# EAGLE schematic Controller Board (EAGLE 9.1.0)

## Sheet 1 of 2
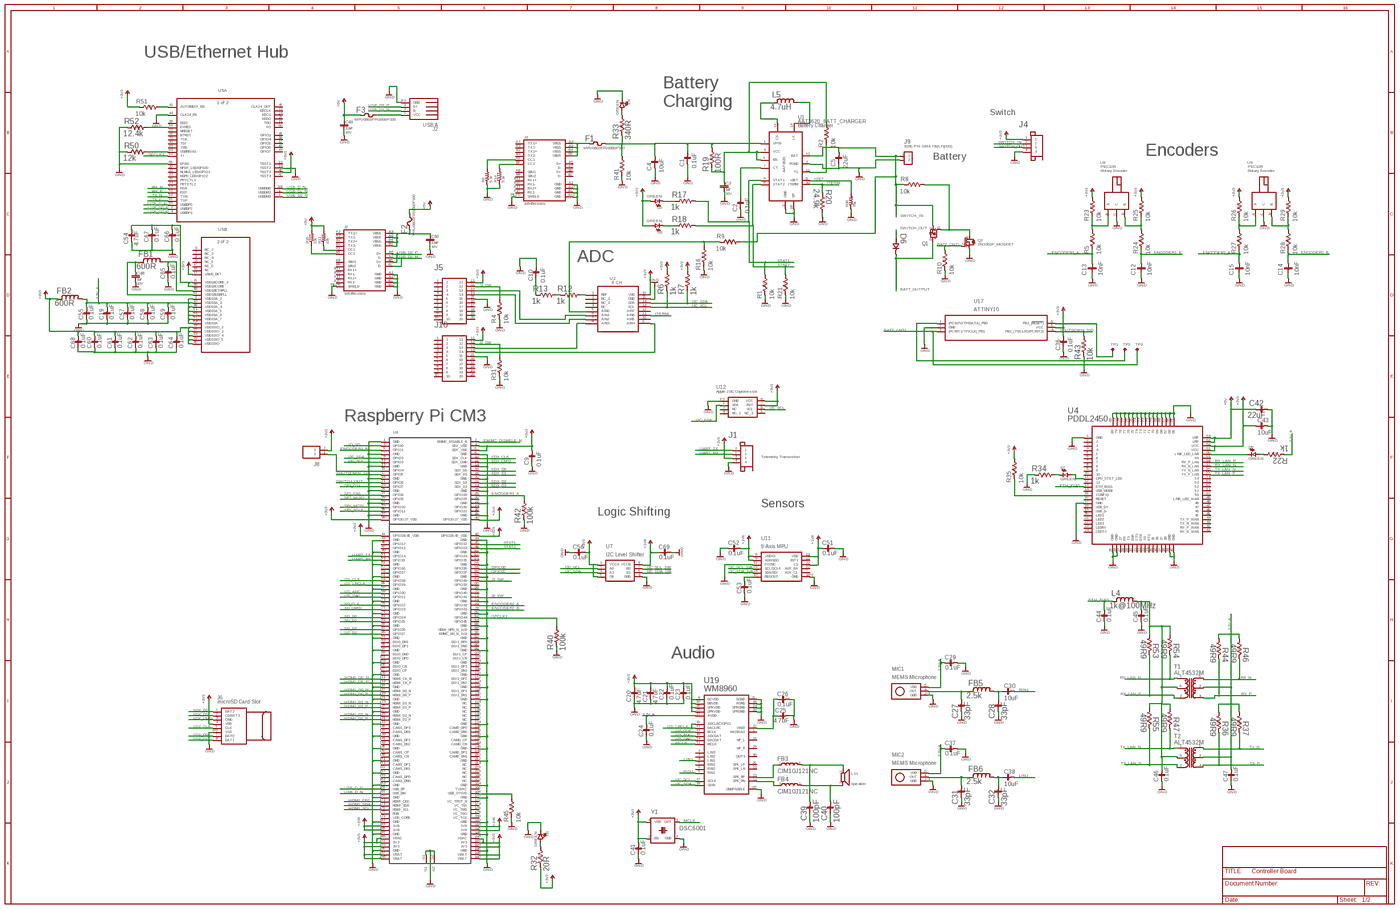
[diagram p0: schematic, sheet 1, overview]
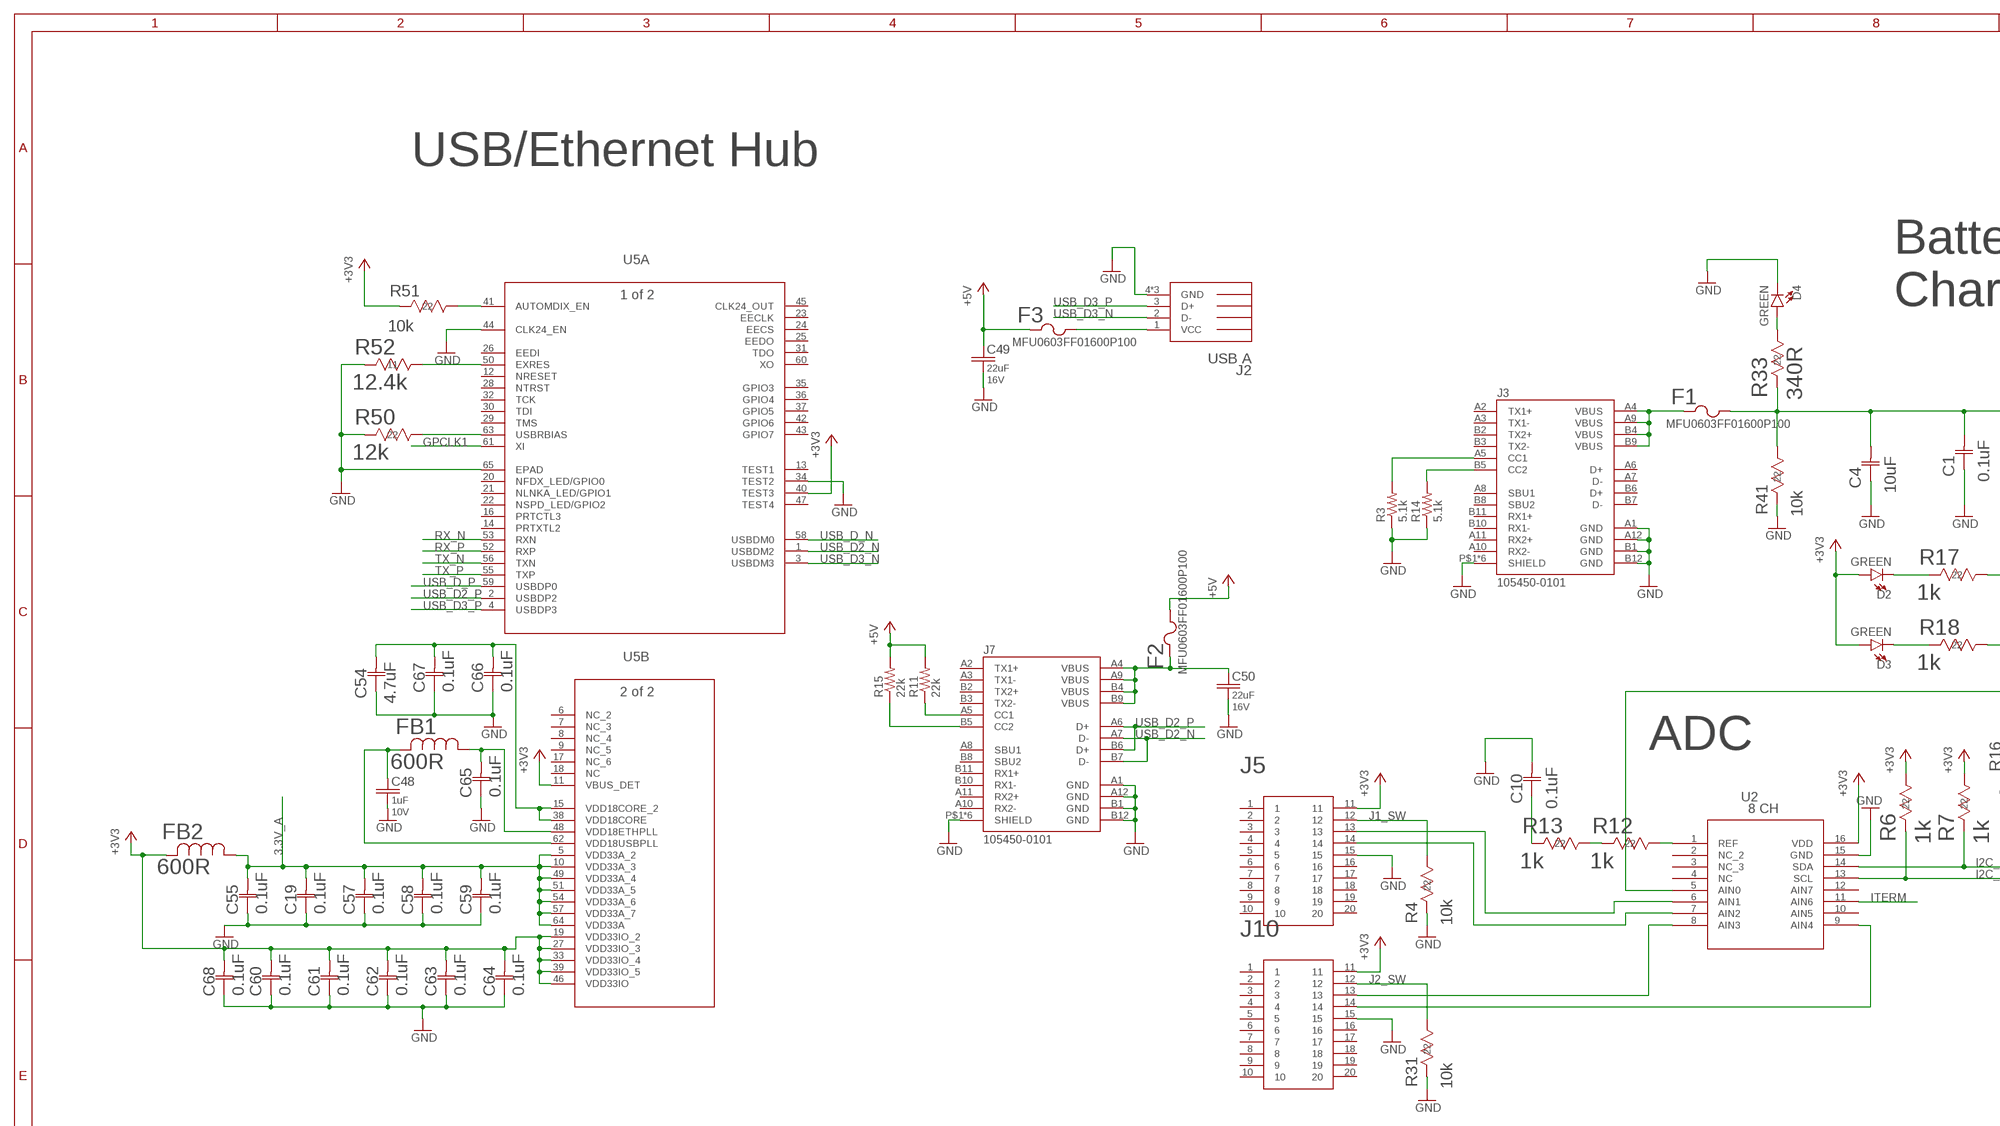
[diagram p1: schematic, sheet 1, part 1 of 4]
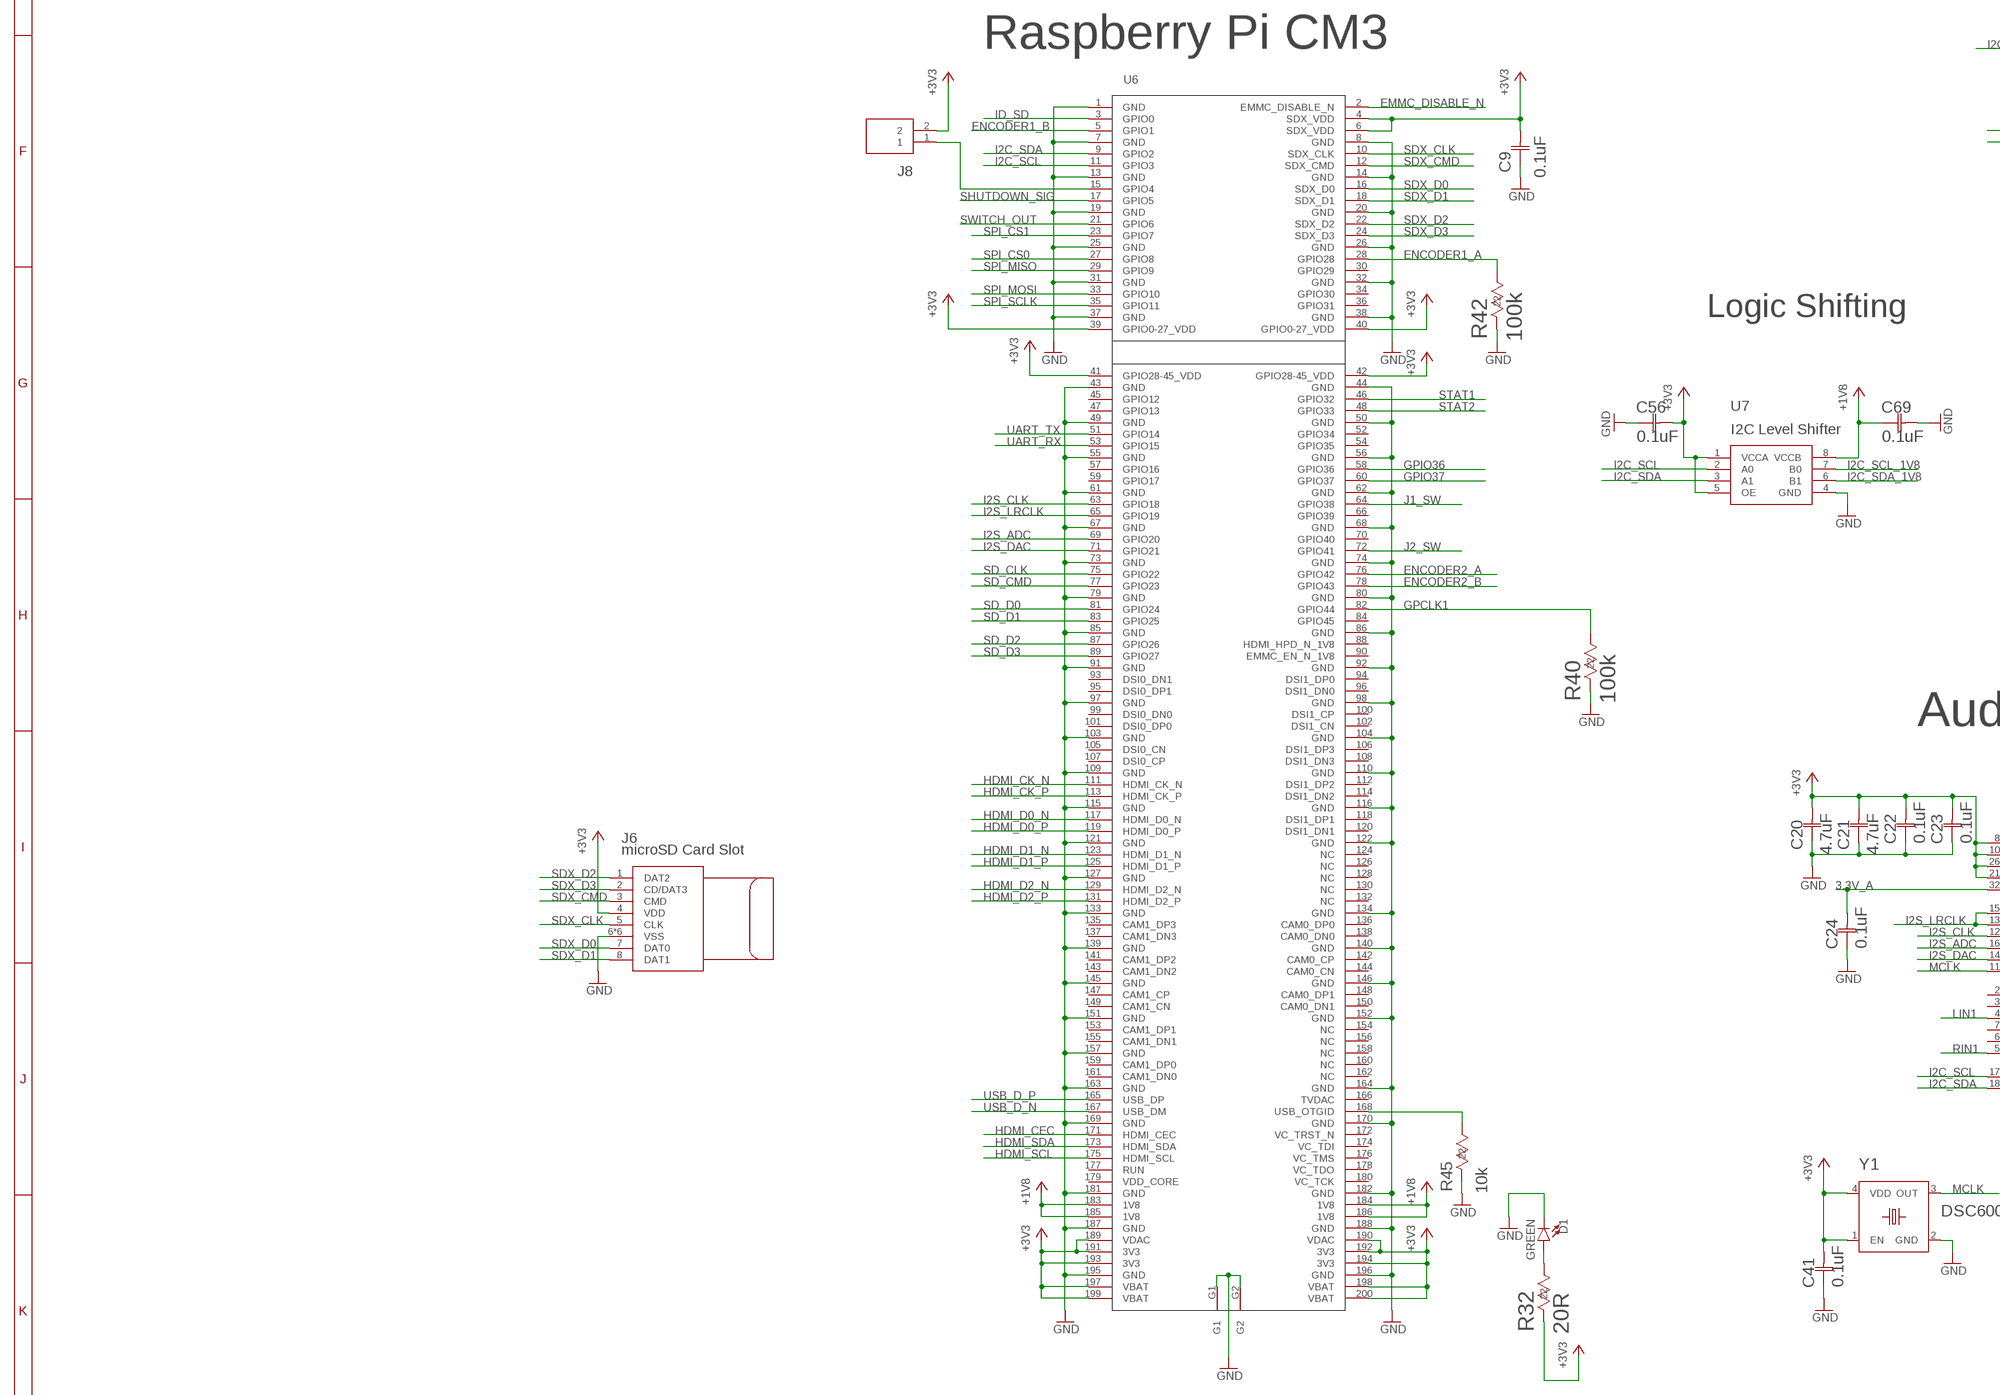
[diagram p2: schematic, sheet 1, part 2 of 4]
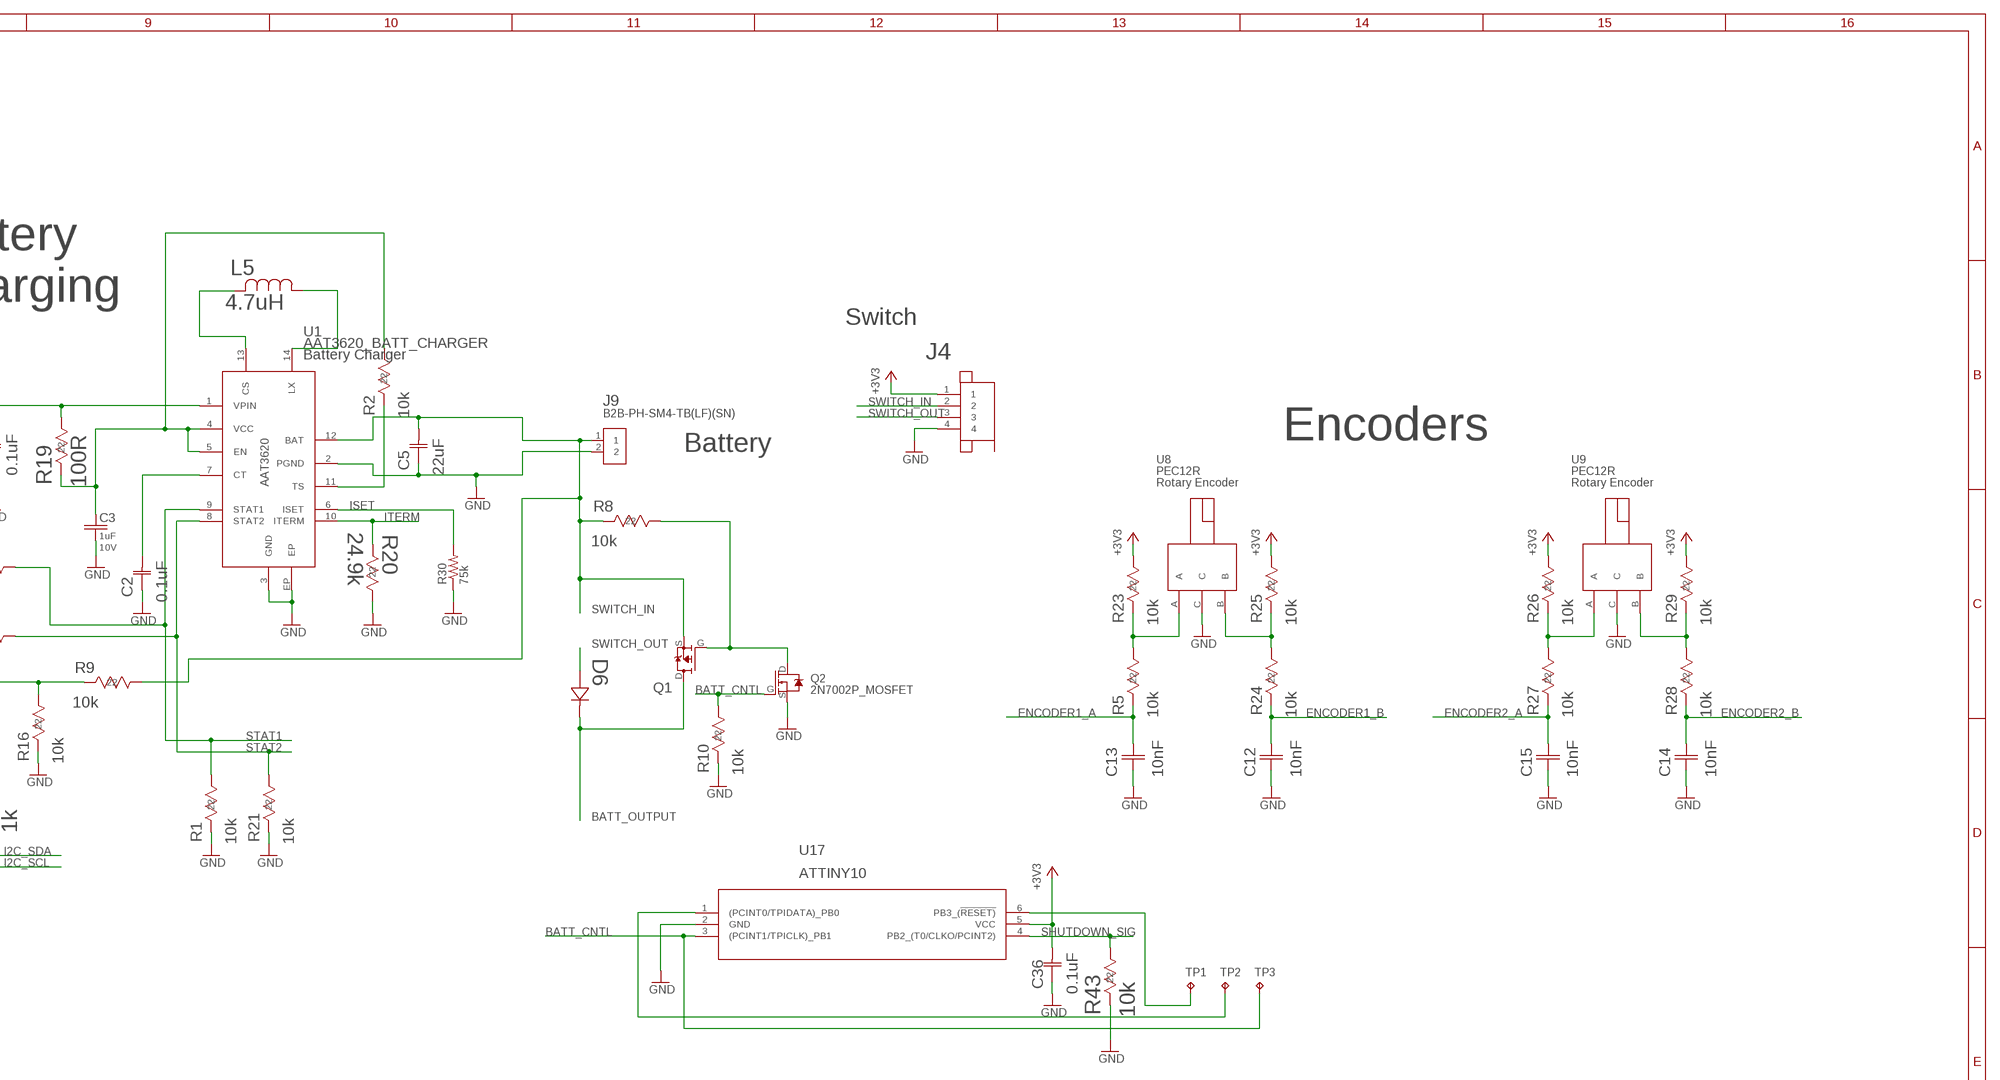
[diagram p3: schematic, sheet 1, part 3 of 4]
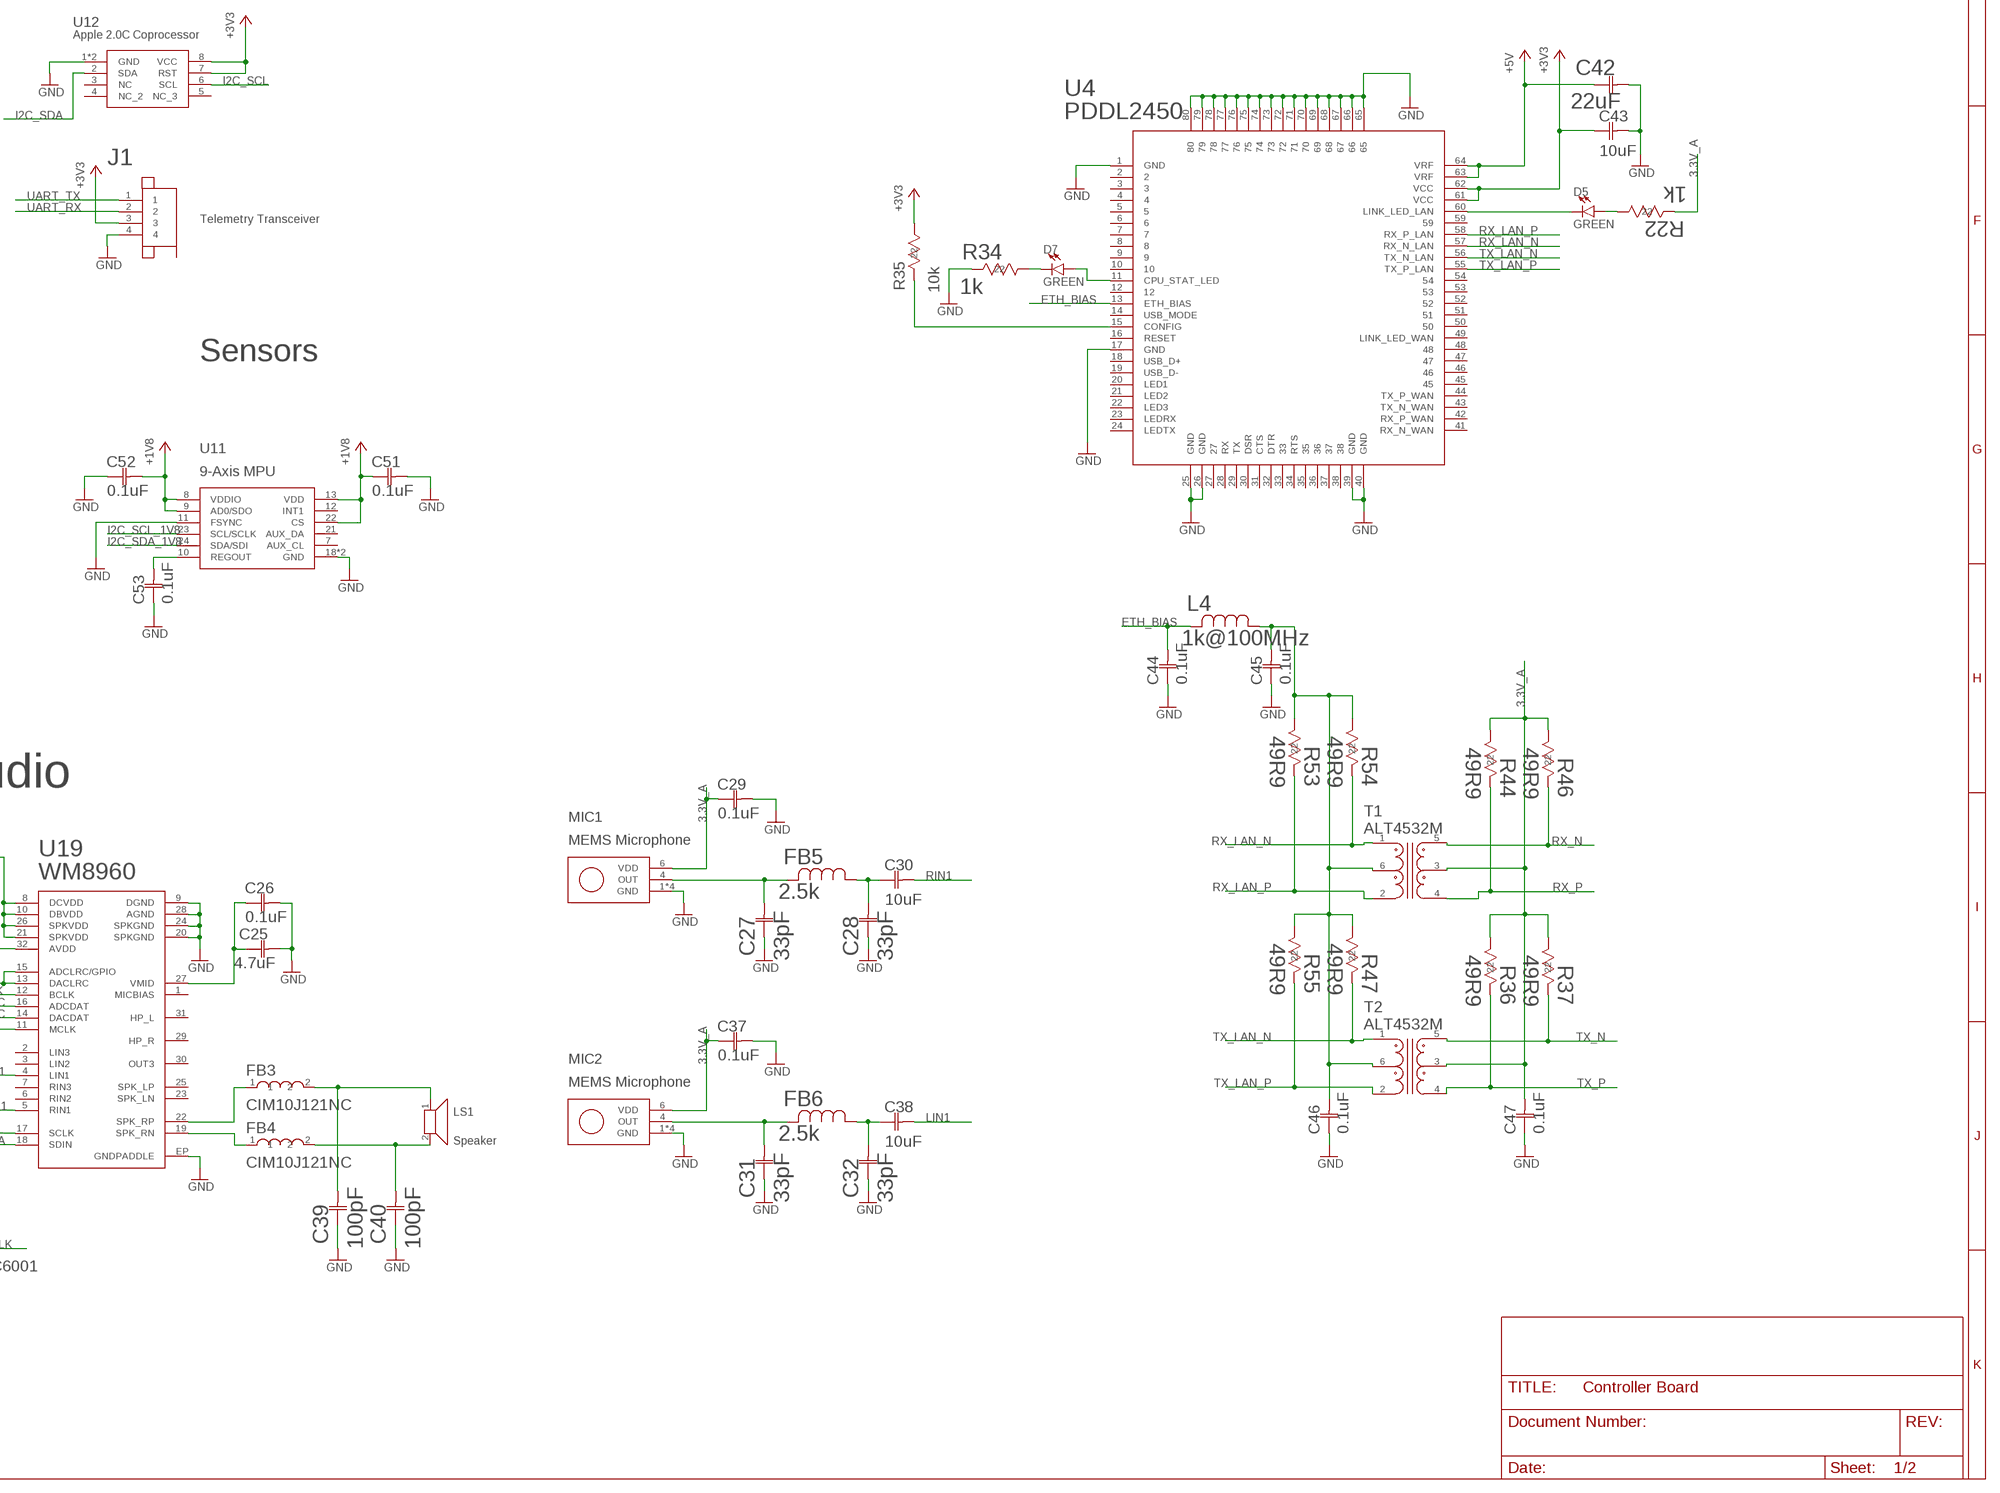
[diagram p4: schematic, sheet 1, part 4 of 4]

### Parts
C1  0.1uF  08055C104KAT2A  [0805]
C2  0.1uF  08055C104KAT2A  [0805]
C3  1uF  CL05A105MP5NNNC  [C0402]
C4  10uF  GRM21BR60J106ME19L  [G-21]
C5  22uF  GRM21BR60J226ME39L  [G-21]
C9  0.1uF  08055C104KAT2A  [0805]
C10  0.1uF  08055C104KAT2A  [0805]
C12  10nF  10NF_CAPACITOR  [0603_CAPACITOR]
C13  10nF  10NF_CAPACITOR  [0603_CAPACITOR]
C14  10nF  10NF_CAPACITOR  [0603_CAPACITOR]
C15  10nF  10NF_CAPACITOR  [0603_CAPACITOR]
C19  0.1uF  0402ZD104KAT2A0402-M  [0402-M]
C20  4.7uF  06036D475KAT2A0603-M  [0603-M]
C21  4.7uF  06036D475KAT2A0603-M  [0603-M]
C22  0.1uF  0402ZD104KAT2A0402-M  [0402-M]
C23  0.1uF  0402ZD104KAT2A0402-M  [0402-M]
C24  0.1uF  0402ZD104KAT2A0402-M  [0402-M]
C25  4.7uF  06036D475KAT2A0603-M  [0603-M]
C26  0.1uF  0402ZD104KAT2A0402-M  [0402-M]
C27  33pF  GRM1555C1H330JA01DG-155-M  [G-155-M]
C28  33pF  GRM1555C1H330JA01DG-155-M  [G-155-M]
C29  0.1uF  0402ZD104KAT2A0402-M  [0402-M]
C30  10uF  GRM21BR60J106ME19L  [G-21]
C31  33pF  GRM1555C1H330JA01DG-155-M  [G-155-M]
C32  33pF  GRM1555C1H330JA01DG-155-M  [G-155-M]
C36  0.1uF  08055C104KAT2A  [0805]
C37  0.1uF  0402ZD104KAT2A0402-M  [0402-M]
C38  10uF  GRM21BR60J106ME19L  [G-21]
C39  100pF  CC0402KRX7R9BB101YAG_CC0402-M  [YAG_CC0402-M]
C40  100pF  CC0402KRX7R9BB101YAG_CC0402-M  [YAG_CC0402-M]
C41  0.1uF  0402ZD104KAT2A0402-M  [0402-M]
C42  22uF  GRM21BR60J226ME39L  [G-21]
C43  10uF  GRM21BR60J106ME19L  [G-21]
C44  0.1uF  0402ZD104KAT2A0402-M  [0402-M]
C45  0.1uF  0402ZD104KAT2A0402-M  [0402-M]
C46  0.1uF  0402ZD104KAT2A0402-M  [0402-M]
C47  0.1uF  0402ZD104KAT2A0402-M  [0402-M]
C48  1uF  CL05A105MP5NNNC  [C0402]
C49  22uF  CL21A226MOCLRNC  [C0805]
C50  22uF  CL21A226MOCLRNC  [C0805]
C51  0.1uF  0402ZD104KAT2A0402-M  [0402-M]
C52  0.1uF  0402ZD104KAT2A0402-M  [0402-M]
C53  0.1uF  0402ZD104KAT2A0402-M  [0402-M]
C54  4.7uF  06036D475KAT2A0603-M  [0603-M]
C55  0.1uF  0402ZD104KAT2A0402-M  [0402-M]
C56  0.1uF  0402ZD104KAT2A0402-M  [0402-M]
C57  0.1uF  0402ZD104KAT2A0402-M  [0402-M]
C58  0.1uF  0402ZD104KAT2A0402-M  [0402-M]
C59  0.1uF  0402ZD104KAT2A0402-M  [0402-M]
C60  0.1uF  0402ZD104KAT2A0402-M  [0402-M]
C61  0.1uF  0402ZD104KAT2A0402-M  [0402-M]
C62  0.1uF  0402ZD104KAT2A0402-M  [0402-M]
C63  0.1uF  0402ZD104KAT2A0402-M  [0402-M]
C64  0.1uF  0402ZD104KAT2A0402-M  [0402-M]
C65  0.1uF  0402ZD104KAT2A0402-M  [0402-M]
C66  0.1uF  0402ZD104KAT2A0402-M  [0402-M]
C67  0.1uF  0402ZD104KAT2A0402-M  [0402-M]
C68  0.1uF  0402ZD104KAT2A0402-M  [0402-M]
C69  0.1uF  0402ZD104KAT2A0402-M  [0402-M]
D1  GREEN  LED-GREEN0603  [LED-0603]
D2  GREEN  LED-GREEN0603  [LED-0603]
D3  GREEN  LED-GREEN0603  [LED-0603]
D4  GREEN  LED-GREEN0603  [LED-0603]
D5  GREEN  LED-GREEN0603  [LED-0603]
D6  1N4148W-7-FSOD123-M  [SOD123-M]
D7  GREEN  LED-GREEN0603  [LED-0603]
F1  MFU0603FF01600P100  [FUS_VISHAY_MFU0603]
F2  MFU0603FF01600P100  [FUS_VISHAY_MFU0603]
F3  MFU0603FF01600P100  [FUS_VISHAY_MFU0603]
FB1  600R  BLM18AG601SN1DIND_BLM18_0603-M  [IND_BLM18_0603-M]
FB2  600R  BLM18AG601SN1DIND_BLM18_0603-M  [IND_BLM18_0603-M]
FB3  CIM10J121NC  [0603_CAPACITOR]
FB4  CIM10J121NC  [0603_CAPACITOR]
FB5  2.5k  BLM18BD252SN1DIND_BLM18_0603-M  [IND_BLM18_0603-M]
FB6  2.5k  BLM18BD252SN1DIND_BLM18_0603-M  [IND_BLM18_0603-M]
J1  JST_SH_4POS  [JST_SH_4POS]
J2  USB_A_RECEPT  [USB_A_RECEPT]
J3  105450-0101  [MOLEX_105450-0101]
J4  JST_SH_4POS  [JST_SH_4POS]
J5  EDGE_CONNECTOR_20POS  [EDGE_CONNECTOR_20POS]
J6  MICROSD  [MICROSD]
J7  105450-0101  [MOLEX_105450-0101]
J8  2_PIN_CONNECTOR  [XH_CONNECTOR]
J9  B2B-PH-SM4-TB(LF)(SN)  [B2B-PH-SM4-TB(LF)(SN)]
J10  EDGE_CONNECTOR_20POS  [EDGE_CONNECTOR_20POS]
L4  1k@100MHz  BLM18AG601SN1DIND_BLM18_0603-M  [IND_BLM18_0603-M]
L5  4.7uH  DFE252012P-4R7M=P2"  [1008]
LS1  SP-1510  [SPEAKER]
MIC1  SPH1642HT5H-1  [SISONIC_MICROPHONE]
MIC2  SPH1642HT5H-1  [SISONIC_MICROPHONE]
Q1  DMP3099L  [SOT-23_(TO-236AB)]
Q2  2N7002P_MOSFET  [SOT-23_(TO-236AB)]
R1  10k  RC0603JR-0710KLRC0603N-M  [RC0603N-M]
R2  10k  RC0603JR-0710KLRC0603N-M  [RC0603N-M]
R3  5.1k  RMCF0603JT5K10  [R0603]
R4  10k  RC0603JR-0710KLRC0603N-M  [RC0603N-M]
R5  10k  RC0603JR-0710KLRC0603N-M  [RC0603N-M]
R6  1k  RC0603JR-071KLRC0603N-M  [RC0603N-M]
R7  1k  RC0603JR-071KLRC0603N-M  [RC0603N-M]
R8  10k  RC0603JR-0710KLRC0603N-M  [RC0603N-M]
R9  10k  RC0603JR-0710KLRC0603N-M  [RC0603N-M]
R10  10k  RC0603JR-0710KLRC0603N-M  [RC0603N-M]
R11  22k  RMCF0603JT22K0  [R0603]
R12  1k  RC0603JR-071KLRC0603N-M  [RC0603N-M]
R13  1k  RC0603JR-071KLRC0603N-M  [RC0603N-M]
R14  5.1k  RMCF0603JT5K10  [R0603]
R15  22k  RMCF0603JT22K0  [R0603]
R16  10k  RC0603JR-0710KLRC0603N-M  [RC0603N-M]
R17  1k  RC0603JR-071KLRC0603N-M  [RC0603N-M]
R18  1k  RC0603JR-071KLRC0603N-M  [RC0603N-M]
R19  100R  RC0603JR-07100RLRC0603N-M  [RC0603N-M]
R20  24.9k  RC0402FR-0724K9LRC0402N-M  [RC0402N-M]
R21  10k  RC0603JR-0710KLRC0603N-M  [RC0603N-M]
R22  1k  RC0603JR-071KLRC0603N-M  [RC0603N-M]
R23  10k  RC0603JR-0710KLRC0603N-M  [RC0603N-M]
R24  10k  RC0603JR-0710KLRC0603N-M  [RC0603N-M]
R25  10k  RC0603JR-0710KLRC0603N-M  [RC0603N-M]
R26  10k  RC0603JR-0710KLRC0603N-M  [RC0603N-M]
R27  10k  RC0603JR-0710KLRC0603N-M  [RC0603N-M]
R28  10k  RC0603JR-0710KLRC0603N-M  [RC0603N-M]
R29  10k  RC0603JR-0710KLRC0603N-M  [RC0603N-M]
R30  75k  RMCF0603JT75K0  [R0603]
R31  10k  RC0603JR-0710KLRC0603N-M  [RC0603N-M]
R32  20R  RC0603JR-0720RLRC0603N-M  [RC0603N-M]
R33  340R  RC0603FR-07340RL  [RC0603N]
R34  1k  RC0603JR-071KLRC0603N-M  [RC0603N-M]
R35  10k  RC0603JR-0710KLRC0603N-M  [RC0603N-M]
R36  49R9  RC0402FR-0749K9LRC0402N-M  [RC0402N-M]
R37  49R9  RC0402FR-0749K9LRC0402N-M  [RC0402N-M]
R40  100k  RC0603JR-07100KLRC0603N-M  [RC0603N-M]
R41  10k  RC0603JR-0710KLRC0603N-M  [RC0603N-M]
R42  100k  RC0603JR-07100KLRC0603N-M  [RC0603N-M]
R43  10k  ERA-6AEB103V  [RC0805N]
R44  49R9  RC0402FR-0749K9LRC0402N-M  [RC0402N-M]
R45  10k  RC0603JR-0710KLRC0603N-M  [RC0603N-M]
R46  49R9  RC0402FR-0749K9LRC0402N-M  [RC0402N-M]
R47  49R9  RC0402FR-0749K9LRC0402N-M  [RC0402N-M]
R50  12k  RC0402FR-0712KLRC0402N-M  [RC0402N-M]
R51  10k  RC0603JR-0710KLRC0603N-M  [RC0603N-M]
R52  12.4k  RC0402FR-0712K4LYAG_R0402-M  [YAG_R0402-M]
R53  49R9  RC0402FR-0749K9LRC0402N-M  [RC0402N-M]
R54  49R9  RC0402FR-0749K9LRC0402N-M  [RC0402N-M]
R55  49R9  RC0402FR-0749K9LRC0402N-M  [RC0402N-M]
T1  ALT4532M  [ALT4532]
T2  ALT4532M  [ALT4532]
TP1  TPB2,54  [B2,54]
TP2  TPB2,54  [B2,54]
TP3  TPB2,54  [B2,54]
U1  AAT3620_BATT_CHARGER  [AAT3620_TDFN]
U2  8 CH  MAX11608EEE+21-0055H_16-M  [21-0055H_16-M]
U4  PDDL2450  [PDDL2450_SOCKET]
U5  LAN9512-JZXQFN64_9X9MC-M  [QFN64_9X9MC-M]
U6  COMPUTE_MODULE  [SO-DIMM]
U7  FXMAR2102  [8-UMLP]
U8  PEC12R  [PEC12R]
U9  PEC12R  [PEC12R]
U11  ICM-20948  [QFN40P300X300X105-25N]
U12  APPLE_2.0C_COPROCESSOR  [PG-USON-8-1]
U17  ATTINY10-TSHR6ST1-M  [6ST1-M]
U19  WM8960  [32QFN]
Y1  DSC6001  [4-VFLGA]

### Nets
3.3V_A: C19.2 C24.2 C29.1 C37.1 C47.2 C55.2 C57.2 C58.2 C59.2 FB2.1 MIC1.6(VDD) MIC2.6(VDD) R22.2 R36.1 R37.1 R44.1 R46.1 T1.3 T2.3 U5.5(B:VDD33A_2) U5.10(B:VDD33A_3) U5.49(B:VDD33A_4) U5.51(B:VDD33A_5) U5.54(B:VDD33A_6) U5.57(B:VDD33A_7) U5.64(B:VDD33A) U19.32(AVDD)
+1V8: C51.1 C52.2 C69.1 U6.183(1V8) U6.184(1V8) U6.185(1V8) U6.186(1V8) U7.8(VCCB) U11.8(VDDIO) U11.9(AD0/SDO) U11.13(VDD) U11.22(CS) ; also sheet 2
+3V3: C9.2 C20.2 C21.2 C22.2 C23.2 C36.2 C41.2 C43.1 C56.2 C60.2 C61.2 C62.2 C63.2 C64.2 C68.2 D2.A D3.A FB2.2 J1.3 J4.1 J5.11 J6.4(VDD) J8.2 J10.11 R6.1 R7.1 R23.1 R25.1 R26.1 R29.1 R32.2 R35.1 R51.2 U2.16(VDD) U4.61(VCC) U4.62(VCC) U5.11(B:VBUS_DET) U5.19(B:VDD33IO_2) U5.27(B:VDD33IO_3) U5.33(B:VDD33IO_4) U5.39(B:VDD33IO_5) U5.40(A:TEST3) U5.46(B:VDD33IO) U6.4(SDX_VDD) U6.6(SDX_VDD) U6.39(GPIO0-27_VDD) U6.40(GPIO0-27_VDD) U6.41(GPIO28-45_VDD) U6.42(GPIO28-45_VDD) U6.189(VDAC) U6.190(VDAC) U6.191(3V3) U6.192(3V3) U6.193(3V3) U6.194(3V3) U6.197(VBAT) U6.198(VBAT) U6.199(VBAT) U6.200(VBAT) U7.1(VCCA) U7.5(OE) U12.7(RST) U12.8(VCC) U17.5(VCC) U19.8(DCVDD) U19.10(DBVDD) U19.21(SPKVDD) U19.26(SPKVDD) Y1.1(EN) Y1.4(VDD) ; also sheet 2
+5V: C42.1 C49.1 F2.2 F3.1 R11.2 R15.2 U4.63(VRF) U4.64(VRF) ; also sheet 2
BATT_CNTL: Q2.G R10.1 TP3.TP U17.3((PCINT1/TPICLK)_PB1)
BATT_OUTPUT: D6.C Q1.D ; also sheet 2
EMMC_DISABLE_N: U6.2(EMMC_DISABLE_N)
ENCODER1_A: C13.2 R5.2 R42.1 U6.28(GPIO28)
ENCODER1_B: C12.2 R24.2 U6.5(GPIO1)
ENCODER2_A: C15.2 R27.2 U6.76(GPIO42)
ENCODER2_B: C14.2 R28.2 U6.78(GPIO43)
ETH_BIAS: C44.2 L4.2 U4.13(ETH_BIAS)
GND: C1.1 C2.1 C3.2 C4.1 C5.1 C9.1 C10.2 C12.1 C13.1 C14.1 C15.1 C19.1 C20.1 C21.1 C22.1 C23.1 C24.1 C25.2 C26.2 C27.1 C28.1 C29.2 C31.1 C32.1 C36.1 C37.2 C39.1 C40.1 C41.1 C42.2 C43.2 C44.1 C45.1 C46.1 C47.1 C48.2 C49.2 C50.2 C51.2 C52.1 C53.1 C54.1 C55.1 C56.1 C57.1 C58.1 C59.1 C60.1 C61.1 C62.1 C63.1 C64.1 C65.1 C66.1 C67.1 C68.1 C69.2 D1.C D4.C J1.4 J2.4(GND) J2.5(GND) J2.6(GND) J3.A1(GND) J3.A12(GND) J3.B1(GND) J3.B12(GND) J3.P$1(SHIELD) J3.P$2(SHIELD) J3.P$3(SHIELD) J3.P$4(SHIELD) J3.P$5(SHIELD) J3.P$6(SHIELD) J4.4 J5.15 J6.6(VSS) J6.9(VSS) J6.10(VSS) J6.11(VSS) J6.12(VSS) J6.13(VSS) J7.A1(GND) J7.A12(GND) J7.B1(GND) J7.B12(GND) J7.P$1(SHIELD) J7.P$2(SHIELD) J7.P$3(SHIELD) J7.P$4(SHIELD) J7.P$5(SHIELD) J7.P$6(SHIELD) J9.2 J10.15 MIC1.1(GND) MIC1.2(GND) MIC1.3(GND) MIC1.5(GND) MIC2.1(GND) MIC2.2(GND) MIC2.3(GND) MIC2.5(GND) Q2.S R1.2 R3.1 R4.2 R10.2 R14.1 R16.2 R20.1 R21.2 R30.1 R31.2 R34.2 R40.2 R41.2 R42.2 R43.2 R45.2 R50.2 R52.1 U1.2(PGND) U1.3(GND) U1.EP U2.15(GND) U4.1(GND) U4.17(GND) U4.25(GND) U4.26(GND) U4.39(GND) U4.40(GND) U4.65 U4.66 U4.67 U4.68 U4.69 U4.70 U4.71 U4.72 U4.73 U4.74 U4.75 U4.76 U4.77 U4.78 U4.79 U4.80 U5.34(A:TEST2) U5.44(A:CLK24_EN) U5.65(A:EPAD) U6.1(GND) U6.7(GND) U6.8(GND) U6.13(GND) U6.14(GND) U6.19(GND) U6.20(GND) U6.25(GND) U6.26(GND) U6.31(GND) U6.32(GND) U6.37(GND) U6.38(GND) U6.43(GND) U6.44(GND) U6.49(GND) U6.50(GND) U6.55(GND) U6.56(GND) U6.61(GND) U6.62(GND) U6.67(GND) U6.68(GND) U6.73(GND) U6.74(GND) U6.79(GND) U6.80(GND) U6.85(GND) U6.86(GND) U6.91(GND) U6.92(GND) U6.97(GND) U6.98(GND) U6.103(GND) U6.104(GND) U6.109(GND) U6.110(GND) U6.115(GND) U6.116(GND) U6.121(GND) U6.122(GND) U6.127(GND) U6.133(GND) U6.134(GND) U6.139(GND) U6.140(GND) U6.145(GND) U6.146(GND) U6.151(GND) U6.152(GND) U6.157(GND) U6.163(GND) U6.164(GND) U6.169(GND) U6.170(GND) U6.181(GND) U6.182(GND) U6.187(GND) U6.188(GND) U6.195(GND) U6.196(GND) U6.G1 U6.G2 U7.4(GND) U8.C U9.C U11.11(FSYNC) U11.18(GND) U11.20(GND) U12.1(GND) U12.9(GND) U17.2(GND) U19.9(DGND) U19.20(SPKGND) U19.24(SPKGND) U19.28(AGND) U19.EP(GNDPADDLE) Y1.2(GND) ; also sheet 2
GND2: D5.C U4.60(LINK_LED_LAN)
GPCLK1: R40.1 U5.61(A:XI) U6.82(GPIO44)
GPIO36: U6.58(GPIO36)
GPIO37: U6.60(GPIO37)
HDMI_CEC: U6.171(HDMI_CEC)
HDMI_CK_N: U6.111(HDMI_CK_N)
HDMI_CK_P: U6.113(HDMI_CK_P)
HDMI_D0_N: U6.117(HDMI_D0_N)
HDMI_D0_P: U6.119(HDMI_D0_P)
HDMI_D1_N: U6.123(HDMI_D1_N)
HDMI_D1_P: U6.125(HDMI_D1_P)
HDMI_D2_N: U6.129(HDMI_D2_N)
HDMI_D2_P: U6.131(HDMI_D2_P)
HDMI_SCL: U6.175(HDMI_SCL)
HDMI_SDA: U6.173(HDMI_SDA)
I2C_SCL: R6.2 U2.13(SCL) U6.11(GPIO3) U7.2(A0) U12.6(SCL) U19.17(SCLK)
I2C_SCL_1V8: U7.7(B0) U11.23(SCL/SCLK)
I2C_SDA: R7.2 U2.14(SDA) U6.9(GPIO2) U7.3(A1) U12.2(SDA) U19.18(SDIN)
I2C_SDA_1V8: U7.6(B1) U11.24(SDA/SDI)
I2S_ADC: U6.69(GPIO20) U19.16(ADCDAT)
I2S_CLK: U6.63(GPIO18) U19.12(BCLK)
I2S_DAC: U6.71(GPIO21) U19.14(DACDAT)
I2S_LRCLK: U6.65(GPIO19) U19.13(DACLRC) U19.15(ADCLRC/GPIO)
ID_SD: U6.3(GPIO0)
ISET: R30.2 U1.6(ISET)
ITERM: R20.2 U1.10(ITERM) U2.11(AIN6)
J1_SW: J5.12 R4.1 U6.64(GPIO38)
J2_SW: J10.12 R31.1 U6.72(GPIO41)
LIN1: C38.2 U19.4(LIN1)
MCLK: U19.11(MCLK) Y1.3(OUT)
N$1: TP1.TP U17.6(PB3_(!RESET))
N$2: C2.2 U1.7(CT)
N$4: L5.P$2 U1.13(CS)
N$5: L5.P$1 U1.14(LX)
N$6: C3.1 R2.1 R19.2 U1.4(VCC) U1.5(EN)
N$7: C53.2 U11.10(REGOUT)
N$9: D4.A R33.1
N$10: D1.A R32.1
N$11: R2.2 U1.11(TS)
N$14: C25.1 C26.1 U19.27(VMID)
N$15: D2.C R17.2
N$16: R12.1 U2.1(REF)
N$17: J5.13 U2.6(AIN1)
N$18: J5.14 U2.7(AIN2)
N$19: J10.13 U2.8(AIN3)
N$20: J10.14 U2.9(AIN4)
N$21: C27.2 FB5.2 MIC1.4(OUT)
N$22: D3.C R18.2
N$24: R12.2 R13.1
N$28: C10.1 R13.2
N$31: R5.1 R23.2 U8.A
N$33: C28.2 C30.1 FB5.1
N$34: R24.1 R25.2 U8.B
N$35: C31.2 FB6.2 MIC2.4(OUT)
N$36: C32.2 C38.1 FB6.1
N$37: R26.2 R27.1 U9.A
N$38: R28.1 R29.2 U9.B
N$39: R9.2 R16.1 U2.5(AIN0)
N$41: FB4.1 U19.19(SPK_RN)
N$43: FB3.1 U19.22(SPK_RP)
N$44: C39.2 FB3.2 LS1.1
N$45: C40.2 FB4.2 LS1.2
N$46: J3.B5(CC2) R14.2
N$47: F1.1 J3.A4(VBUS) J3.A9(VBUS) J3.B4(VBUS) J3.B9(VBUS)
N$49: J3.A5(CC1) R3.2
N$50: J7.A5(CC1) R11.1
N$51: C50.1 F2.1 J7.A4(VBUS) J7.A9(VBUS) J7.B4(VBUS) J7.B9(VBUS)
N$53: R45.1 U6.168(USB_OTGID)
N$54: J8.1 U6.15(GPIO4)
N$55: R51.1 U5.41(A:AUTOMDIX_EN)
N$56: R50.1 U5.63(A:USBRBIAS)
N$57: Q1.G Q2.D R8.1
N$58: C65.2 FB1.1 U5.48(B:VDD18ETHPLL)
N$59: C48.1 FB1.2 U5.62(B:VDD18USBPLL)
N$60: R52.2 U5.50(A:EXRES)
N$62: C54.2 C66.2 C67.2 U5.15(B:VDD18CORE_2) U5.38(B:VDD18CORE)
N$63: J7.B5(CC2) R15.1
N$66: D5.A R22.1
N$67: R35.2 U4.15(CONFIG)
N$68: D7.A U4.11(CPU_STAT_LED)
N$69: D7.C R34.1
N$70: C45.2 C46.2 L4.1 R47.1 R53.1 R54.1 R55.1 T1.6 T2.6
N$71: F3.2 J2.1(VCC)
PB0: TP2.TP U17.1((PCINT0/TPIDATA)_PB0)
RIN1: C30.2 U19.5(RIN1)
RX_LAN_N: R54.2 T1.1 U4.57(RX_N_LAN)
RX_LAN_P: R53.2 T1.2 U4.58(RX_P_LAN)
RX_N: R46.2 T1.5 U5.53(A:RXN)
RX_P: R44.2 T1.4 U5.52(A:RXP)
SD_CLK: U6.75(GPIO22)
SD_CMD: U6.77(GPIO23)
SD_D0: U6.81(GPIO24)
SD_D1: U6.83(GPIO25)
SD_D2: U6.87(GPIO26)
SD_D3: U6.89(GPIO27)
SDX_CLK: J6.5(CLK) U6.10(SDX_CLK)
SDX_CMD: J6.3(CMD) U6.12(SDX_CMD)
SDX_D0: J6.7(DAT0) U6.16(SDX_D0)
SDX_D1: J6.8(DAT1) U6.18(SDX_D1)
SDX_D2: J6.1(DAT2) U6.22(SDX_D2)
SDX_D3: J6.2(CD/DAT3) U6.24(SDX_D3)
SHUTDOWN_SIG: R43.1 U6.17(GPIO5) U17.4(PB2_(T0/CLKO/PCINT2))
SPI_CS0: U6.27(GPIO8)
SPI_CS1: U6.23(GPIO7)
SPI_MISO: U6.29(GPIO9)
SPI_MOSI: U6.33(GPIO10)
SPI_SCLK: U6.35(GPIO11)
STAT1: R1.1 R17.1 U1.9(STAT1) U6.46(GPIO32)
STAT2: R18.1 R21.1 U1.8(STAT2) U6.48(GPIO33)
SWITCH_IN: C5.2 J4.2 J9.1 Q1.S R8.2 R9.1 U1.12(BAT)
SWITCH_OUT: D6.A J4.3 U6.21(GPIO6)
TX_LAN_N: R47.2 T2.1 U4.56(TX_N_LAN)
TX_LAN_P: R55.2 T2.2 U4.55(TX_P_LAN)
TX_N: R37.2 T2.5 U5.56(A:TXN)
TX_P: R36.2 T2.4 U5.55(A:TXP)
UART_RX: J1.2 U6.53(GPIO15)
UART_TX: J1.1 U6.51(GPIO14)
USB_5V: C1.2 C4.2 F1.2 R19.1 R33.2 R41.1 U1.1(VPIN)
USB_D2_N: J7.A7(D-) J7.B7(D-) U5.1(A:USBDM2)
USB_D2_P: J7.A6(D+) J7.B6(D+) U5.2(A:USBDP2)
USB_D3_N: J2.2(D-) U5.3(A:USBDM3)
USB_D3_P: J2.3(D+) U5.4(A:USBDP3)
USB_D_N: U5.58(A:USBDM0) U6.167(USB_DM)
USB_D_P: U5.59(A:USBDP0) U6.165(USB_DP)
Unconnected: J1.P$5 J1.P$6 J3.A2(TX1+) J3.A3(TX1-) J3.A6(D+) J3.A7(D-) J3.A8(SBU1) J3.A10(RX2-) J3.A11(RX2+) J3.B2(TX2+) J3.B3(TX2-) J3.B6(D+) J3.B7(D-) J3.B8(SBU2) J3.B10(RX1-) J3.B11(RX1+) J4.P$5 J4.P$6 J5.1 J5.2 J5.3 J5.4 J5.5 J5.6 J5.7 J5.8 J5.9 J5.10 J5.16 J5.17 J5.18 J5.19 J5.20 J7.A2(TX1+) J7.A3(TX1-) J7.A8(SBU1) J7.A10(RX2-) J7.A11(RX2+) J7.B2(TX2+) J7.B3(TX2-) J7.B8(SBU2) J7.B10(RX1-) J7.B11(RX1+) J10.1 J10.2 J10.3 J10.4 J10.5 J10.6 J10.7 J10.8 J10.9 J10.10 J10.16 J10.17 J10.18 J10.19 J10.20 U2.2(NC_2) U2.3(NC_3) U2.4(NC) U2.10(AIN5) U2.12(AIN7) U4.2 U4.3 U4.4 U4.5 U4.6 U4.7 U4.8 U4.9 U4.10 U4.12 U4.14(USB_MODE) U4.16(RESET) U4.18(USB_D+) U4.19(USB_D-) U4.20(LED1) U4.21(LED2) U4.22(LED3) U4.23(LEDRX) U4.24(LEDTX) U4.27 U4.28(RX) U4.29(TX) U4.30(DSR) U4.31(CTS) U4.32(DTR) U4.33 U4.34(RTS) U4.35 U4.36 U4.37 U4.38 U4.41(RX_N_WAN) U4.42(RX_P_WAN) U4.43(TX_N_WAN) U4.44(TX_P_WAN) U4.45 U4.46 U4.47 U4.48 U4.49(LINK_LED_WAN) U4.50 U4.51 U4.52 U4.53 U4.54 U4.59 U5.6(B:NC_2) U5.7(B:NC_3) U5.8(B:NC_4) U5.9(B:NC_5) U5.12(A:NRESET) U5.13(A:TEST1) U5.14(A:PRTXTL2) U5.16(A:PRTCTL3) U5.17(B:NC_6) U5.18(B:NC) U5.20(A:NFDX_LED/GPIO0) U5.21(A:NLNKA_LED/GPIO1) U5.22(A:NSPD_LED/GPIO2) U5.23(A:EECLK) U5.24(A:EECS) U5.25(A:EEDO) U5.26(A:EEDI) U5.28(A:NTRST) U5.29(A:TMS) U5.30(A:TDI) U5.31(A:TDO) U5.32(A:TCK) U5.35(A:GPIO3) U5.36(A:GPIO4) U5.37(A:GPIO5) U5.42(A:GPIO6) U5.43(A:GPIO7) U5.45(A:CLK24_OUT) U5.47(A:TEST4) U5.60(A:XO) U6.30(GPIO29) U6.34(GPIO30) U6.36(GPIO31) U6.45(GPIO12) U6.47(GPIO13) U6.52(GPIO34) U6.54(GPIO35) U6.57(GPIO16) U6.59(GPIO17) U6.66(GPIO39) U6.70(GPIO40) U6.84(GPIO45) U6.88(HDMI_HPD_N_1V8) U6.90(EMMC_EN_N_1V8) U6.93(DSI0_DN1) U6.94(DSI1_DP0) U6.95(DSI0_DP1) U6.96(DSI1_DN0) U6.99(DSI0_DN0) U6.100(DSI1_CP) U6.101(DSI0_DP0) U6.102(DSI1_CN) U6.105(DSI0_CN) U6.106(DSI1_DP3) U6.107(DSI0_CP) U6.108(DSI1_DN3) U6.112(DSI1_DP2) U6.114(DSI1_DN2) U6.118(DSI1_DP1) U6.120(DSI1_DN1) U6.124(NC) U6.126(NC) U6.128(NC) U6.130(NC) U6.132(NC) U6.135(CAM1_DP3) U6.136(CAM0_DP0) U6.137(CAM1_DN3) U6.138(CAM0_DN0) U6.141(CAM1_DP2) U6.142(CAM0_CP) U6.143(CAM1_DN2) U6.144(CAM0_CN) U6.147(CAM1_CP) U6.148(CAM0_DP1) U6.149(CAM1_CN) U6.150(CAM0_DN1) U6.153(CAM1_DP1) U6.154(NC) U6.155(CAM1_DN1) U6.156(NC) U6.158(NC) U6.159(CAM1_DP0) U6.160(NC) U6.161(CAM1_DN0) U6.162(NC) U6.166(TVDAC) U6.172(VC_TRST_N) U6.174(VC_TDI) U6.176(VC_TMS) U6.177(RUN) U6.178(VC_TDO) U6.179(VDD_CORE) U6.180(VC_TCK) U11.7(AUX_CL) U11.12(INT1) U11.21(AUX_DA) U12.3(NC) U12.4(NC_2) U12.5(NC_3) U19.1(MICBIAS) U19.2(LIN3) U19.3(LIN2) U19.6(RIN2) U19.7(RIN3) U19.23(SPK_LN) U19.25(SPK_LP) U19.29(HP_R) U19.30(OUT3) U19.31(HP_L)

### Notes on the sheet
- USB/Ethernet Hub
- Battery
  Charging
- Switch
- Encoders
- Battery
- ADC
- Raspberry Pi CM3
- Telemetry Transceiver
- Sensors
- Logic Shifting
- Audio

## Sheet 2 of 2
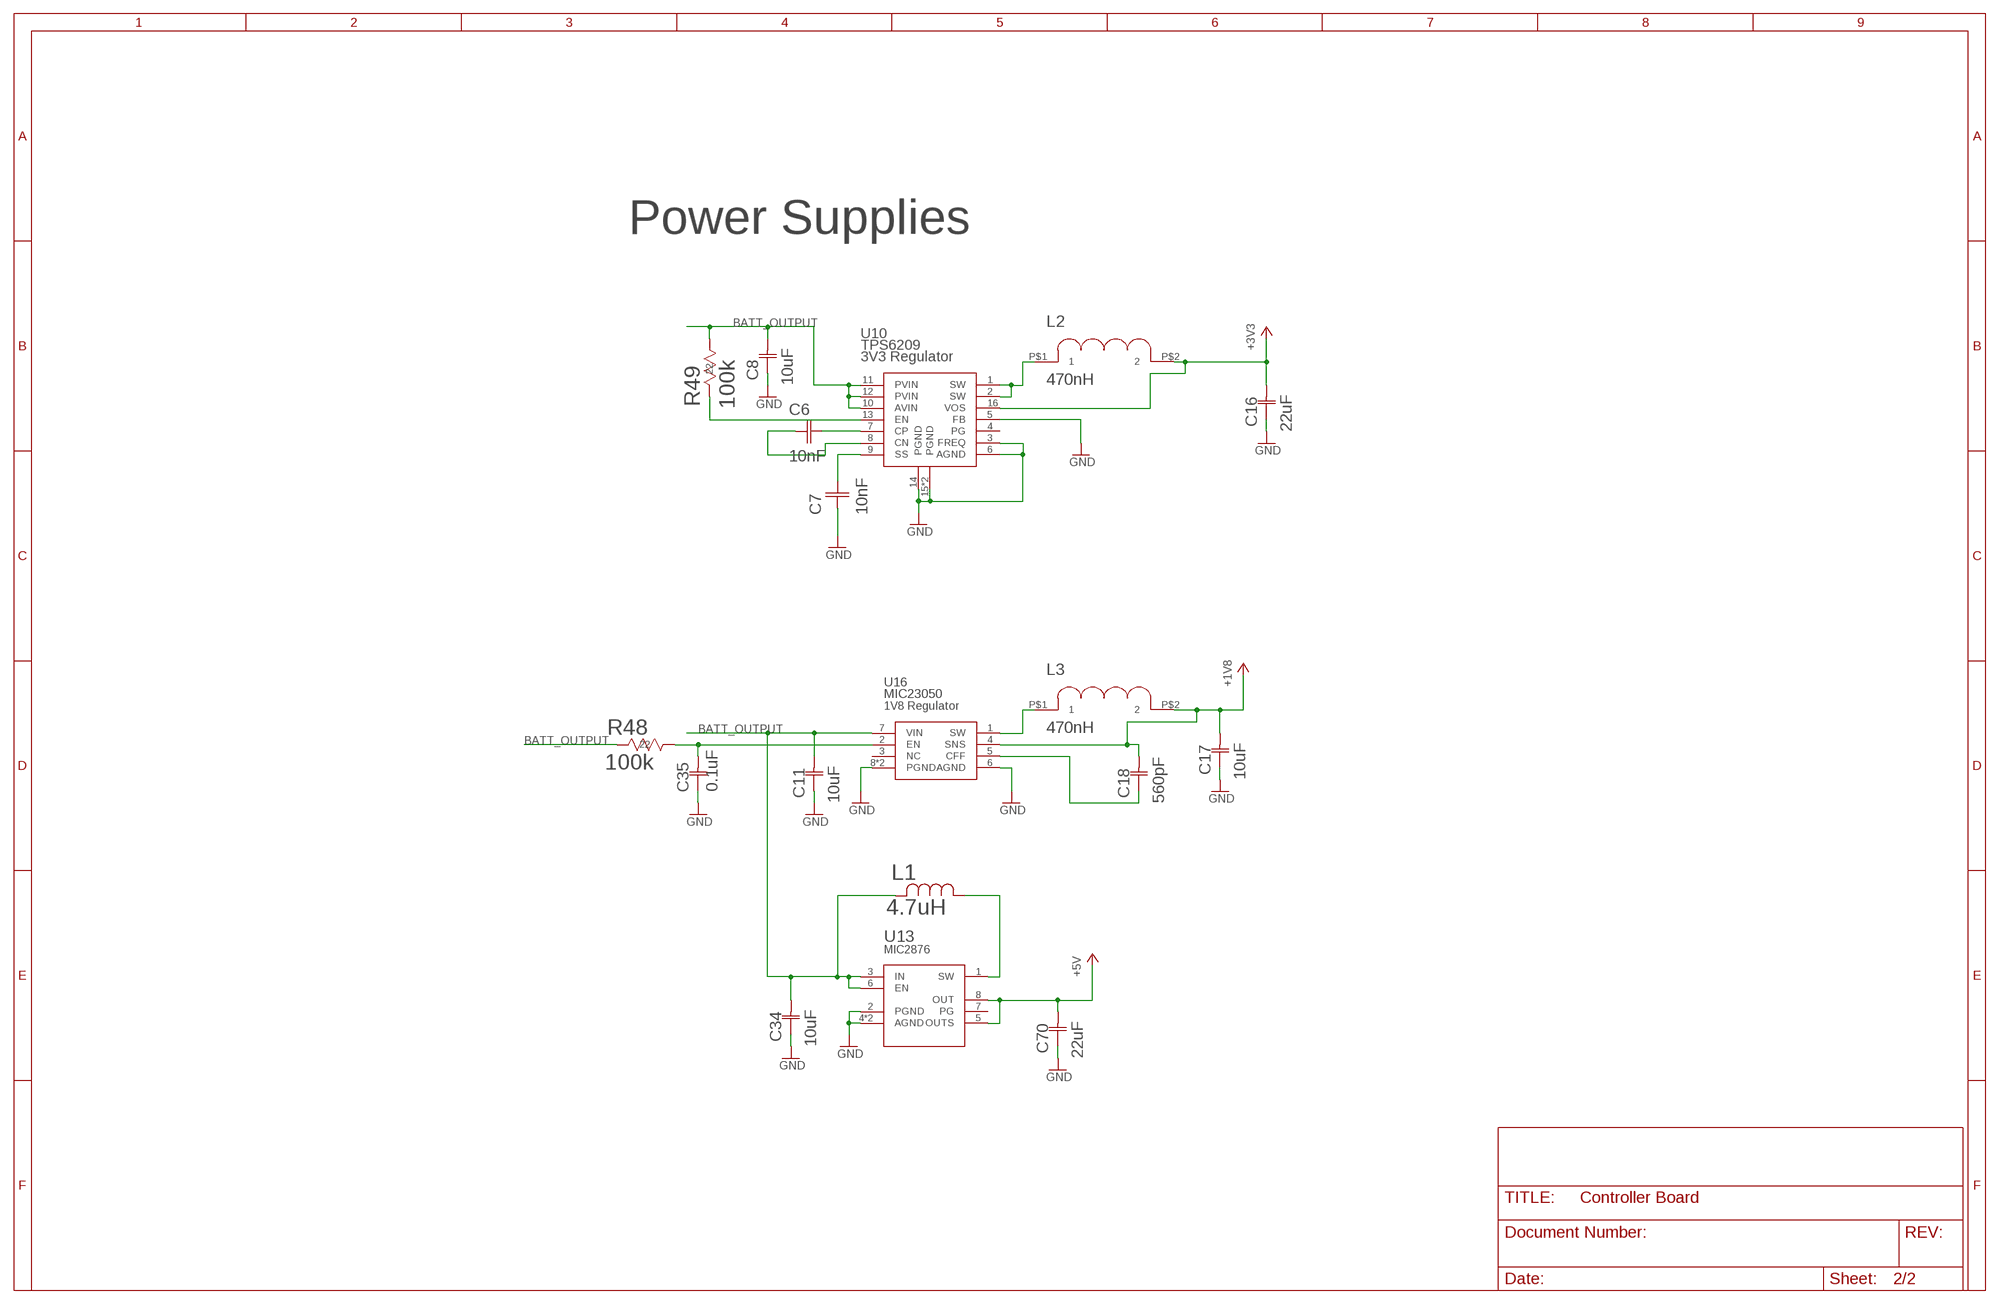
[diagram p5: schematic, sheet 2]

### Parts
C6  10nF  10NF_CAPACITOR  [0603_CAPACITOR]
C7  10nF  10NF_CAPACITOR  [0603_CAPACITOR]
C8  10uF  GRM21BR60J106ME19L  [G-21]
C11  10uF  GRM21BR60J106ME19L  [G-21]
C16  22uF  GRM21BR60J226ME39L  [G-21]
C17  10uF  GRM21BR60J106ME19L  [G-21]
C18  560pF  CC0402KRX7R9BB561CC0402N-M  [CC0402N-M]
C34  10uF  GRM21BR60J106ME19L  [G-21]
C35  0.1uF  0402ZD104KAT2A0402-M  [0402-M]
C70  22uF  GRM21BR60J226ME39L  [G-21]
L1  4.7uH  DFE252012P-4R7M=P2"  [1008]
L2  470nH  470NH_INDUCTOR  [470NH_INDUCTOR]
L3  470nH  470NH_INDUCTOR  [470NH_INDUCTOR]
R48  100k  RC0603JR-07100KLRC0603N-M  [RC0603N-M]
R49  100k  RC0603JR-07100KLRC0603N-M  [RC0603N-M]
U10  TPS6209  [VQFN16]
U13  MIC2876UDFN-8  [UDFN8]
U16  MIC23050  [MLF(ML)_8PIN]

### Nets
+1V8: C17.2 C18.2 L3.P$2 U16.4(SNS) ; also sheet 1
+3V3: C16.2 L2.P$2 U10.16(VOS) ; also sheet 1
+5V: C70.2 U13.5(OUTS) U13.8(OUT) ; also sheet 1
BATT_OUTPUT: C8.2 C11.2 C34.2 L1.P$2 R48.2 R49.1 U10.10(AVIN) U10.11(PVIN) U10.12(PVIN) U13.3(IN) U13.6(EN) U16.7(VIN) ; also sheet 1
GND: C7.1 C8.1 C11.1 C16.1 C17.1 C34.1 C35.1 C70.1 U10.3(FREQ) U10.5(FB) U10.6(AGND) U10.14(PGND) U10.15(PGND) U10.17(PGND) U13.2(PGND) U13.4(AGND) U13.EP(AGND) U16.6(AGND) U16.8(PGND) U16.EP(PGND) ; also sheet 1
N$3: R49.2 U10.13(EN)
N$12: C35.2 R48.1 U16.2(EN)
N$13: C6.2 U10.7(CP)
N$23: C6.1 U10.8(CN)
N$29: C7.2 U10.9(SS)
N$30: L2.P$1 U10.1(SW) U10.2(SW)
N$32: L3.P$1 U16.1(SW)
N$48: C18.1 U16.5(CFF)
N$61: L1.P$1 U13.1(SW)
Unconnected: U10.4(PG) U13.7(PG) U16.3(NC)

### Notes on the sheet
- Power Supplies

## Library data of the parts
C1 C2 C9 C10 C36 = Controller Board:08055C104KAT2A; COPYRIGHT: Copyright C 2015 Accelerated Designs. All rights reserved; MANUFACTURER_PART_NUMBER: 08055C104KAT2A; VENDOR: Vendor
C3 C48 = thanics-capacitor:CL05A105MP5NNNC; RATING: 10V
C4 C8 C11 C17 C34 = Controller Board:GRM21BR60J106ME19L; COPYRIGHT: Copyright C 2015 Accelerated Designs. All rights reserved; MANUFACTURER_PART_NUMBER: GRM21BR60J106ME19L; VENDOR: Vendor
C5 C16 C70 = Controller Board:GRM21BR60J226ME39L; COPYRIGHT: Copyright C 2015 Accelerated Designs. All rights reserved; MANUFACTURER_PART_NUMBER: GRM21BR60J226ME39L; VENDOR: Vendor
C6 C7 C12-C15 = Controller Board:10NF_CAPACITOR
C18 = Controller Board:CC0402KRX7R9BB561; MANUFACTURER_PART_NUMBER: CC0402KRX7R9BB561; VENDOR: Yageo
C19 C22-C24 C26 C29 C35 C37 C41 C44-C47 C51-C53 C55-C69 = 0.1uF-capacitor-0402:0402ZD104KAT2A; MANUFACTURER_PART_NUMBER: 0402ZD104KAT2A; VENDOR: AVX Corporation
C20 C21 C25 C54 = 4.7uF-capacitor:06036D475KAT2A; MANUFACTURER_PART_NUMBER: 06036D475KAT2A; VENDOR: AVX Corporation
C27 C28 C31 C32 = 33pF-capacitor:GRM1555C1H330JA01D; MANUFACTURER_PART_NUMBER: GRM1555C1H330JA01D; VENDOR: Murata
C30 C38 C43 = 10uF X5R Ceramic Capacitor:GRM21BR60J106ME19L; COPYRIGHT: Copyright C 2015 Accelerated Designs. All rights reserved; MANUFACTURER_PART_NUMBER: GRM21BR60J106ME19L; VENDOR: Vendor
C39 C40 = 100pF-capacitor:CC0402KRX7R9BB101; MANUFACTURER_PART_NUMBER: CC0402KRX7R9BB101; VENDOR: Yageo
C42 = 22uF X5R Ceramic Capacitor:GRM21BR60J226ME39L; COPYRIGHT: Copyright C 2015 Accelerated Designs. All rights reserved; MANUFACTURER_PART_NUMBER: GRM21BR60J226ME39L; VENDOR: Vendor
C49 C50 = thanics-capacitor:CL21A226MOCLRNC; RATING: 16V
D1-D4 = Controller Board:LED-GREEN: Green SMD LED Used in manufacturing of various products at SparkFun Packages: 0603 - SMD 0603 package [Product Link] <http://www.futureelectronics.com/en/technologies/semiconductors/optoelectronics/leds/Pages/9894312-LTST-C190GKT.aspx?CrossPart=HSMG-C190&IM=0> LilyPad 1206 - SMD1206 LilyPad package [Product Link] <http://www.futureelectronics.com/en/Technologies/Product.aspx?ProductID=IN150NGHARVATEKCORPORATION2049943&IM=0> 1206 - SMD1206 package [Product Link] <http://www.futureelectronics.com/en/technologies/semiconductors/optoelectronics/leds/Pages/8315665-LTST-C150KGKT.aspx?IM=0> 1206 Bottom Mount -SMD 1206 Bottom Mount [Product Link] <http://www.digikey.com/product-detail/en/lite-on-inc/LTST-C230KGKT/160-1456-1-ND/386854> SparkFun Products: Pro Mini 328 -5V <https://www.sparkfun.com/products/821> RedBoard <https://www.sparkfun.com/products/12757> MP3 Trigger <https://www.sparkfun.com/products/13720> Makey Makey <https://www.sparkfun.com/products/11076>; PROD_ID: DIO-00821
D5 D7 = SparkFun-LED:LED-GREEN: Green SMD LED Used in manufacturing of various products at SparkFun Packages: 0603 - SMD 0603 package [Product Link] <http://www.futureelectronics.com/en/technologies/semiconductors/optoelectronics/leds/Pages/9894312-LTST-C190GKT.aspx?CrossPart=HSMG-C190&IM=0> LilyPad 1206 - SMD1206 LilyPad package [Product Link] <http://www.futureelectronics.com/en/Technologies/Product.aspx?ProductID=IN150NGHARVATEKCORPORATION2049943&IM=0> 1206 - SMD1206 package [Product Link] <http://www.futureelectronics.com/en/technologies/semiconductors/optoelectronics/leds/Pages/8315665-LTST-C150KGKT.aspx?IM=0> 1206 Bottom Mount -SMD 1206 Bottom Mount [Product Link] <http://www.digikey.com/product-detail/en/lite-on-inc/LTST-C230KGKT/160-1456-1-ND/386854> SparkFun Products: Pro Mini 328 -5V <https://www.sparkfun.com/products/821> RedBoard <https://www.sparkfun.com/products/12757> MP3 Trigger <https://www.sparkfun.com/products/13720> Makey Makey <https://www.sparkfun.com/products/11076>; PROD_ID: DIO-00821
D6 = Controller Board:1N4148W-7-F; COPYRIGHT: Copyright C 2015 Accelerated Designs. All rights reserved; MANUFACTURER_PART_NUMBER: 1N4148W7F; VENDOR: Diodes Inc
F1-F3 = 1.6a-fuse:MFU0603FF01600P100; MANUFACTURER_PART_NUMBER: MFU0603FF01600P100; VENDOR: VISHAY
FB1 FB2 L4 = 600ohm-fb:BLM18AG601SN1D; MANUFACTURER_PART_NUMBER: BLM18AG601SN1D; VENDOR: MURATA
FB3 FB4 = thanics_robotics:CIM10J121NC
FB5 FB6 = 2.5k-fb:BLM18BD252SN1D; MANUFACTURER_PART_NUMBER: BLM18BD252SN1D; VENDOR: MURATA
J1 J4 = thanics_robotics:JST_SH_4POS
J2 = Controller Board:USB_A_RECEPT
J3 J7 = 105450-0101:105450-0101: USB Shielded I/O Receptacle; Type C; Right Angle; Surface Mount; Gold over Nickel; DESCRIPTION: USB Shielded I/O Receptacle; Type C; Right Angle; Surface Mount; Gold over Nickel; DIGI-KEY_PART_NUMBER: WM12856CT-ND; DIGI-KEY_PURCHASE_URL: https://www.digikey.com/product-detail/en/molex-llc/1054500101/WM12856CT-ND/5843891?utm_source=snapeda&utm_medium=aggregator&utm_campaign=symbol; MF: Molex; MP: 1054500101; PACKAGE: None
J5 J10 = thanics_robotics:EDGE_CONNECTOR_20POS
J6 = Controller Board:MICROSD
J8 = Controller Board:2_PIN_CONNECTOR
J9 = thanics-connector:B2B-PH-SM4-TB(LF)(SN)
L1 L5 = 4.7uH-inductor:DFE252012P-4R7M=P2
L2 L3 = Controller Board:470NH_INDUCTOR
LS1 = thanics_robotics:SP-1510
MIC1 MIC2 = thanics_robotics:SPH1642HT5H-1
Q1 = Controller Board:DMP3099L
Q2 = Controller Board:2N7002P_MOSFET
R1 R2 R4 R5 R8-R10 R16 R21 R23-R29 R31 R35 R41 R45 R51 = 10k-resistor(0603):RC0603JR-0710KL; MANUFACTURER_PART_NUMBER: RC0603JR0710KL; VENDOR: Yageo
R3 R14 = thanics-resistor:RMCF0603JT5K10; TOLERANCE: 5%
R6 R7 R12 R13 = Controller Board:RC0603JR-071KL; CASE: 0603 1608 metric; COMPOSITION: Thick Film; COPYRIGHT: Copyright C 2015 Accelerated Designs. All rights reserved; DATASHEET: httpwww.yageo.comdocumentsrecentPYuRC0603_51_RoHS_L_4.pdf; DESCRIPTION: RES 1.0K OHM 110W 5% 0603 SMD; DIGIKEYPARTNUMBER: 3111.0KGRTRND; HEIGHT: 0.022" 0.55mm; LEADSTYLE: Surface Mount SMD SMT; MANUFACTURER_PART_NUMBER: RC0603JR071KL; NEWARKPARTNUMBER: 14M7231; NUMBEROFTERMINATIONS: 2; PACKAGECASE: 0603 1608 Metric; PACKAGING: Tape &amp Reel TR; POWERWATTS: 0.1W 110W; QUANTITY_AVAILABLE: 0; RESISTANCEINOHMS: 1.00K; RESISTANCEOHMS: 1K; SIZEDIMENSION: 0.063" L x 0.031" W 1.60mm x 0.80mm; TEMPERATURECOEFFICIENT: 100ppm°C; TOLERANCE: 5%; VENDOR: Yageo; VOLTAGEWORKING: 50V
R11 R15 = thanics-resistor:RMCF0603JT22K0; TOLERANCE: 5%
R17 R18 R22 R34 = 1k-resistor:RC0603JR-071KL; CASE: 0603 1608 metric; COMPOSITION: Thick Film; COPYRIGHT: Copyright C 2015 Accelerated Designs. All rights reserved; DATASHEET: httpwww.yageo.comdocumentsrecentPYuRC0603_51_RoHS_L_4.pdf; DESCRIPTION: RES 1.0K OHM 110W 5% 0603 SMD; DIGIKEYPARTNUMBER: 3111.0KGRTRND; HEIGHT: 0.022" 0.55mm; LEADSTYLE: Surface Mount SMD SMT; MANUFACTURER_PART_NUMBER: RC0603JR071KL; NEWARKPARTNUMBER: 14M7231; NUMBEROFTERMINATIONS: 2; PACKAGECASE: 0603 1608 Metric; PACKAGING: Tape &amp Reel TR; POWERWATTS: 0.1W 110W; QUANTITY_AVAILABLE: 0; RESISTANCEINOHMS: 1.00K; RESISTANCEOHMS: 1K; SIZEDIMENSION: 0.063" L x 0.031" W 1.60mm x 0.80mm; TEMPERATURECOEFFICIENT: 100ppm°C; TOLERANCE: 5%; VENDOR: Yageo; VOLTAGEWORKING: 50V
R19 = 100-resistor:RC0603JR-07100RL; MANUFACTURER_PART_NUMBER: RC0603JR07100RL; VENDOR: Yageo
R20 = Controller Board:RC0402FR-0724K9L; MANUFACTURER_PART_NUMBER: RC0402FR0724K9L; VENDOR: Yageo
R30 = thanics-resistor:RMCF0603JT75K0; TOLERANCE: 5%
R32 = Controller Board:RC0603JR-0720RL; MANUFACTURER_PART_NUMBER: RC0603JR0720RL; VENDOR: Yageo
R33 = Controller Board:RC0603FR-07340RL; CASE: 0603 1608 metric; COMPOSITION: Thick Film; COPYRIGHT: Copyright C 2015 Accelerated Designs. All rights reserved; DATASHEET: httpwww.yageo.comdocumentsrecentPYuRC0603_51_RoHS_L_4.pdf; DIGIKEYPARTNUMBER: 311340HRTRND; HEIGHT: 0.022" 0.55mm; LEADSTYLE: Surface Mount SMD SMT; MANUFACTURER_PART_NUMBER: RC0603FR07340RL; NEWARKPARTNUMBER: 66R2325; NUMBEROFTERMINATIONS: 2; PACKAGECASE: 0603 1608 Metric; PACKAGING: Tape &amp Reel TR; POWERWATTS: 0.1W 110W; QUANTITY_AVAILABLE: 95000; RESISTANCEINOHMS: 340; RESISTANCEOHMS: 340; SIZEDIMENSION: 0.063" L x 0.031" W 1.60mm x 0.80mm; TEMPERATURECOEFFICIENT: 100ppm°C; TOLERANCE: 1%; VENDOR: Yageo; VOLTAGEWORKING: 50V
R36 R37 R44 R46 R47 R53-R55 = 49.9-resistor:RC0402FR-0749K9L; MANUFACTURER_PART_NUMBER: RC0402FR0749K9L; VENDOR: Yageo
R40 R42 R48 R49 = Controller Board:RC0603JR-07100KL; MANUFACTURER_PART_NUMBER: RC0603JR07100KL; VENDOR: Yageo
R43 = Controller Board:ERA-6AEB103V; CASE: 0805 2012 metric; COMPOSITION: Thin Film; COPYRIGHT: Copyright C 2015 Accelerated Designs. All rights reserved; DATASHEET: httpindustrial.panasonic.comwwwcgijvcr13pz.cgi?E+PZ+3+AOA0026+ERA6AEB103V+7+WW; DIGIKEYPARTNUMBER: P10KDATRND; HEIGHT: 0.024" 0.60mm; LEADSTYLE: Surface Mount SMD SMT; MANUFACTURER_PART_NUMBER: ERA6AEB103V; NUMBEROFTERMINATIONS: 2; PACKAGECASE: 0805 2012 Metric; PACKAGING: Tape &amp Reel TR; POWERWATTS: 0.125W 18W; QUANTITY_AVAILABLE: 225000; RESISTANCEINOHMS: 10.0K; RESISTANCEOHMS: 10K; SIZEDIMENSION: 0.079" L x 0.049" W 2.00mm x 1.25mm; TEMPERATURECOEFFICIENT: 25ppm°C; TOLERANCE: 0.1%; VENDOR: Panasonic; VOLTAGEWORKING: 100V
R50 = 12k-resistor:RC0402FR-0712KL; MANUFACTURER_PART_NUMBER: RC0402FR0712KL; VENDOR: Yageo
R52 = 12.4k-resistor:RC0402FR-0712K4L; MANUFACTURER_PART_NUMBER: RC0402FR0712K4L; VENDOR: Yageo
T1 T2 = thanics_robotics:ALT4532M
TP1-TP3 = testpad:TP: Test pad
U1 = Controller Board:AAT3620_BATT_CHARGER
U2 = Controller Board:MAX11608EEE+; COPYRIGHT: Copyright C 2015 Accelerated Designs. All rights reserved; DATAINTERFACE: I²C Serial; DATASHEET: httpdatasheets.maximic.comendsMAX11606MAX11611.pdf; DESCRIPTION: IC ADC SERIAL 10BIT 8CH 16QSOP; DIGIKEYPARTNUMBER: MAX11608EEE+ND; MANUFACTURER_PART_NUMBER: MAX11608EEE+; MOUNTINGTYPE: Surface Mount; NUMBEROFBITS: 10; NUMBEROFCONVERTERS: 1; NUMBEROFINPUTSANDTYPE: 8 SingleEnded Unipolar 8 SingleEnded Bipolar 4 Differential Unipolar 4 Differential Bipolar; OPERATINGTEMPERATURE: 40°C ~ 85°C; PACKAGECASE: 16SSOP 0.154" 3.90mm Width; PACKAGING: Tube; POWERDISSIPATIONMAX: 666.7mW; QUANTITY_AVAILABLE: 814; SAMPLINGRATEPERSECOND: 94.4k; SUPPLIERDEVICEPACKAGE: 16QSOP; VENDOR: Maxim Integrated Products; VOLTAGESUPPLYSOURCE: Single Supply
U4 = thanics_robotics:PDDL2450
U5 = lan9512:LAN9512-JZX; MANUFACTURER_PART_NUMBER: LAN9512JZX; VENDOR: MICROCHIP
U6 = Controller Board:COMPUTE_MODULE: Raspberry Pi Compute Module www.hasseb.fi
U7 = thanics_robotics:FXMAR2102
U8 U9 = Controller Board:PEC12R
U10 = Controller Board:TPS6209
U11 = ICM-20948-mpu:ICM-20948
U12 = Controller Board:APPLE_2.0C_COPROCESSOR
U13 = thanics_robotics:MIC2876
U16 = Controller Board:MIC23050
U17 = Controller Board:ATTINY10-TSHR; MANUFACTURER_PART_NUMBER: ATTINY10TSHR; VENDOR: Atmel
U19 = thanics_robotics:WM8960
Y1 = thanics_robotics:DSC6001